# Altium project PCB_Project.PrjPcb
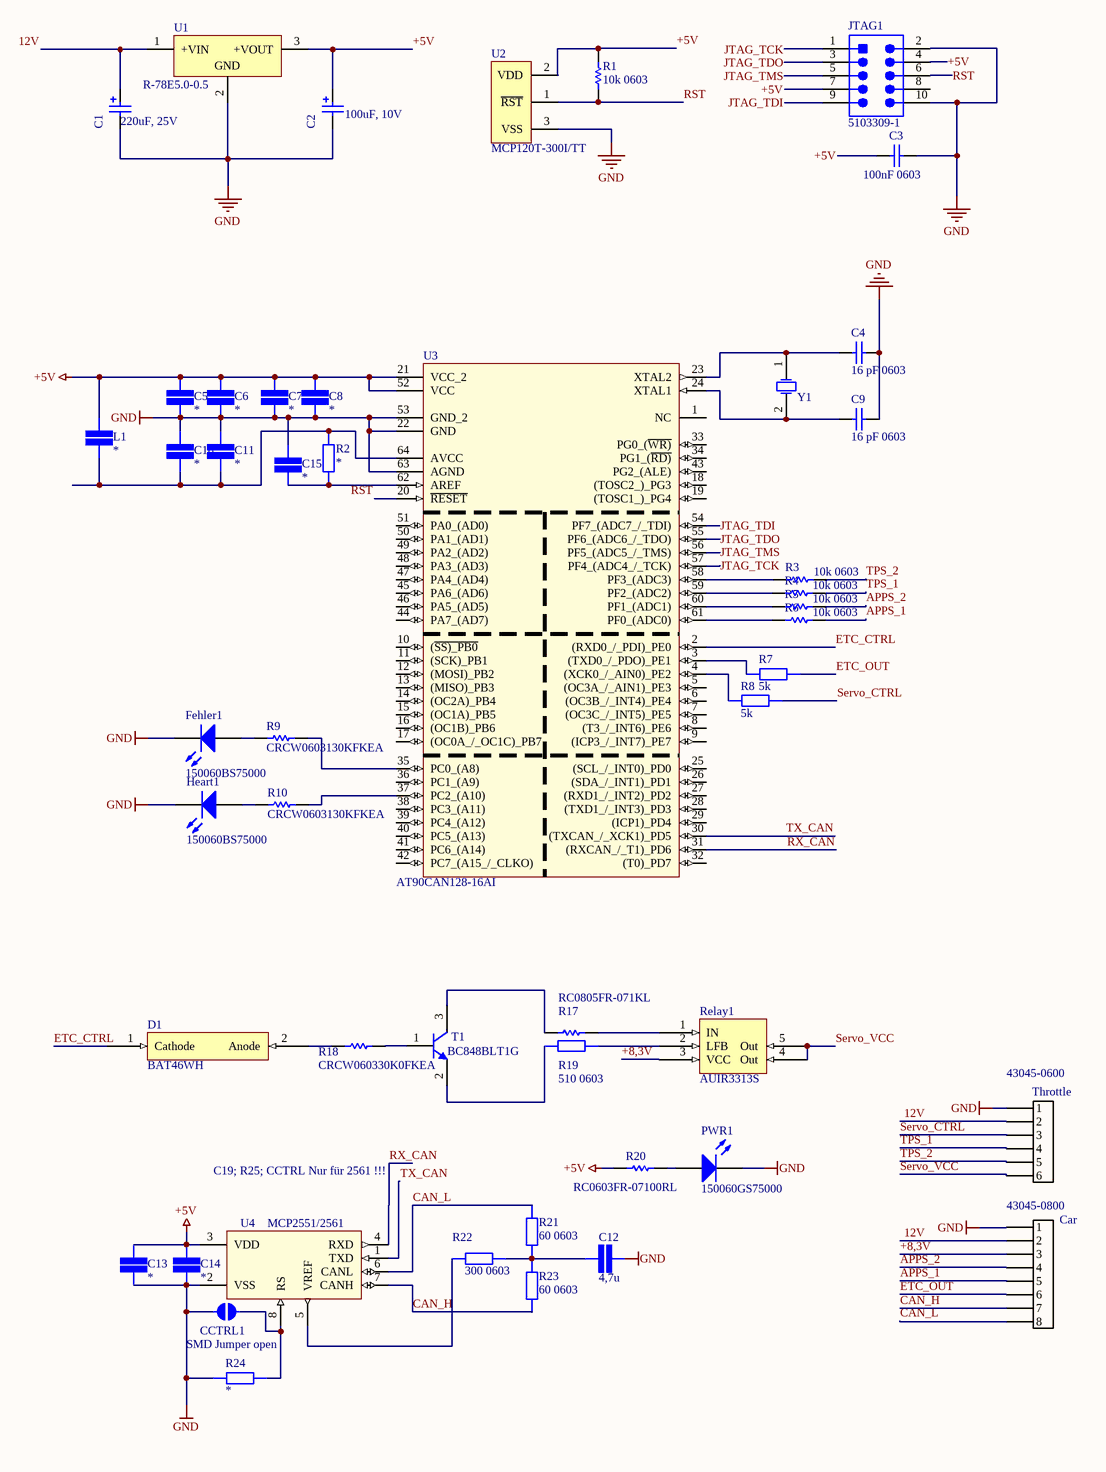
[diagram p0: Main_ETC.SchDoc]
1 sheet, 49 parts. Net scope: global (net labels, ports and power ports of the same name join across sheets).
Board file: PCB_ETCV1_1.PcbDoc

## Sheet Main_ETC.SchDoc
size A3

### Parts
C1  220uF, 25V  [WCAP-ATET_10x12.5]
C2  100uF, 10V  [WCAP-ASLU_6.3x7.7]
C3  100nF 0603  [CAPC0603(1608)100_L]
C4  16 pF 0603  [CAPC0603(1608)100_L]
C5  SMD Capacitor  [CAP 0603/1608]  (value not drawn)
C6  SMD Capacitor  [CAP 0603/1608]  (value not drawn)
C7  SMD Capacitor  [CAP 0603/1608]  (value not drawn)
C8  SMD Capacitor  [CAP 0603/1608]  (value not drawn)
C9  16 pF 0603  [CAPC0603(1608)100_L]
C10  SMD Capacitor  [CAP 0603/1608]  (value not drawn)
C11  SMD Capacitor  [CAP 0603/1608]  (value not drawn)
C12  value 4,7u  [CAP 0603/1608]  (hidden comment: SMD Capacitor)
C13  SMD Capacitor  [CAP 0603/1608]  (value not drawn)
C14  SMD Capacitor  [CAP 0603/1608]  (value not drawn)
C15  SMD Capacitor  [CAP 0603/1608]  (value not drawn)
Car  43045-0800  [43045-0800]
CCTRL1  SMD Jumper open  [SMD-JUMPER-OPEN]  (no BOM)
D1  BAT46WH  [DIOM2715X18N]
Fehler1  150060BS75000  [0603_A]
Heart1  150060BS75000  [0603_A]
JTAG1  5103309-1  [TECO-5103309-1_V]
L1  SMD Capacitor  [CAP 0603/1608]  (value not drawn)
PWR1  150060GS75000  [0603_A]
R1  10k 0603  [RESC0603(1608)_N]
R2  SMD Resistor  [STACKPOLE CSR0603]  (value not drawn)
R3  10k 0603  [RESC0603(1608)_N]
R4  10k 0603  [RESC0603(1608)_N]
R5  10k 0603  [RESC0603(1608)_N]
R6  10k 0603  [RESC0603(1608)_N]
R7  value 5k  [STACKPOLE CSR0603]  (hidden comment: SMD Resistor)
R8  value 5k  [STACKPOLE CSR0603]  (hidden comment: SMD Resistor)
R9  CRCW0603130KFKEA  [RESC1609X50X30NL10T20]
R10  CRCW0603130KFKEA  [RESC1609X50X30NL10T20]
R17  RC0805FR-071KL  [RESC2013X60X35ML10T20]
R18  CRCW060330K0FKEA  [RESC1609X50X30LL10T20]
R19  value 510 0603  [STACKPOLE CSR0603]  (hidden comment: SMD Resistor)
R20  RC0603FR-07100RL  [RESC1608X55X25ML10T15]
R21  value 60 0603  [STACKPOLE CSR0603]  (hidden comment: SMD Resistor)
R22  value 300 0603  [STACKPOLE CSR0603]  (hidden comment: SMD Resistor)
R23  value 60 0603  [STACKPOLE CSR0603]  (hidden comment: SMD Resistor)
R24  SMD Resistor  [STACKPOLE CSR0603]  (value not drawn)
Relay1  AUIR3313S  [D2PAK5 ;DPAK228P1524X483-5N]
T1  BC848BLT1G  [ONSC-SOT-23-3-318-08_V]
Throttle  43045-0600  [43045-0600]
U1  R-78E5.0-0.5  [REPO-R-78E-0.5-3_V]
U2  MCP120T-300I/TT  [SOT-23-TT3_N]
U3  AT90CAN128-16AI  [*QFP80P1600X1600X120-64N]
U4  MCP2551/2561  [*SOIC127P600X175-8N]
Y1  16MHz, +/-30ppm, 16pF  [WE-XTAL_HC49/4HSMX]  (value not drawn)

### Nets
+5V: C2.2(P) C3.1 C5.2 C6.2 C7.2 C8.2 C13.2 C14.2 JTAG1.4 JTAG1.7 L1.2 R1.1 R20.1 U1.3(+VOUT) U2.2(VDD) U3.21(VCC_2) U3.52(VCC) U4.3(VDD)
GND: C1.1(N) C2.1(N) C3.2 C4.2 C5.1 C6.1 C7.1 C8.1 C9.2 C10.2 C11.2 C13.1 C14.1 C15.2 Car.1 CCTRL1.1 Fehler1.1(K) Heart1.1(K) JTAG1.2 JTAG1.10 PWR1.1(K) R24.1 Throttle.1 U1.2(GND) U2.3(VSS) U3.22(GND) U3.53(GND_2) U3.63(AGND) U4.2(VSS)
12V: C1.2(P) Car.2 Throttle.2 U1.1(+VIN)
+8,3V: Car.3 Relay1.3(VCC)
APPS_1: Car.5 R6.1
APPS_2: Car.4 R5.1
CAN_H: Car.7 R23.2 U4.7(CANH)
CAN_L: Car.8 R21.1 U4.6(CANL)
ETC_CTRL: D1.1(Cathode) U3.2((RXD0_/_PDI)_PE0)
ETC_OUT: Car.6 R7.1
JTAG_TCK: JTAG1.1 U3.57(PF4_(ADC4_/_TCK))
JTAG_TDI: JTAG1.9 U3.54(PF7_(ADC7_/_TDI))
JTAG_TDO: JTAG1.3 U3.55(PF6_(ADC6_/_TDO))
JTAG_TMS: JTAG1.5 U3.56(PF5_(ADC5_/_TMS))
RST: JTAG1.6 R1.2 U2.1(~{RST}) U3.20(~{RESET})
RX_CAN: U3.31((RXCAN_/_T1)_PD6) U4.4(RXD)
Servo_CTRL: R8.1 Throttle.3
Servo_VCC: Relay1.4(Out) Relay1.5(Out) Throttle.6
TPS_1: R4.1 Throttle.4
TPS_2: R3.1 Throttle.5
TX_CAN: U3.30((TXCAN_/_XCK1)_PD5) U4.1(TXD)
NetC4_1: C4.1 U3.23(XTAL2) Y1.1(OSC1)
NetC9_1: C9.1 U3.24(XTAL1) Y1.2(OSC2)
NetC10_1: C10.1 C11.1 L1.1 R2.2 U3.64(AVCC)
NetC12_1: C12.1 R21.2 R22.2 R23.1
NetC15_1: C15.1 R2.1 U3.62(AREF)
NetCCTRL1_2: CCTRL1.2 R24.2 U4.8(RS)
NetD1_2: D1.2(Anode) R18.1
NetFehler1_2: Fehler1.2(A) R9.2
NetHeart1_2: Heart1.2(A) R10.2
NetPWR1_2: PWR1.2(A) R20.2
NetR3_2: R3.2 U3.58(PF3_(ADC3))
NetR4_2: R4.2 U3.59(PF2_(ADC2))
NetR5_2: R5.2 U3.60(PF1_(ADC1))
NetR6_2: R6.2 U3.61(PF0_(ADC0))
NetR7_2: R7.2 U3.3((TXD0_/_PDO)_PE1)
NetR8_2: R8.2 U3.4((XCK0_/_AIN0)_PE2)
NetR9_1: R9.1 U3.35(PC0_(A8))
NetR10_1: R10.1 U3.37(PC2_(A10))
NetR17_1: R17.1 T1.3(C)
NetR17_2: R17.2 Relay1.1(IN)
NetR18_2: R18.2 T1.1(B)
NetR19_1: R19.1 T1.2(E)
NetR19_2: R19.2 Relay1.2(LFB)
NetR22_1: R22.1 U4.5(VREF)

Not connected (* = marked no-connect by the designer): C12 2; JTAG1 8; U3 1(NC) 5((OC3A_/_AIN1)_PE3) 6((OC3B_/_INT4)_PE4) 7((OC3C_/_INT5)_PE5) 8((T3_/_INT6)_PE6) 9((ICP3_/_INT7)_PE7) 10((~{SS)_PB0}) 11((SCK)_PB1) 12((MOSI)_PB2) 13((MISO)_PB3) 14((OC2A)_PB4) 15((OC1A)_PB5) 16((OC1B)_PB6) 17((OC0A_/_OC1C)_PB7) 18((TOSC2_)_PG3) 19((TOSC1_)_PG4) 25((SCL_/_INT0)_PD0) 26((SDA_/_INT1)_PD1) 27((RXD1_/_INT2)_PD2) 28((TXD1_/_INT3)_PD3) 29((ICP1)_PD4) 32((T0)_PD7) 33(PG0_(~{WR)}) 34(PG1_(~{RD)}) 36(PC1_(A9)) 38(PC3_(A11)) 39(PC4_(A12)) 40(PC5_(A13)) 41(PC6_(A14)) 42(PC7_(A15_/_CLKO)) 43(PG2_(ALE)) 44(PA7_(AD7)) 45(PA6_(AD6)) 46(PA5_(AD5)) 47(PA4_(AD4)) 48(PA3_(AD3)) 49(PA2_(AD2)) 50(PA1_(AD1)) 51(PA0_(AD0))

### Notes on the sheet
- C19; R25; CCTRL Nur für 2561 !!!
- Labels drawn without touching a wire or pin: GND

### Library data of the parts
C1 = 860130475006: WCAP-ATET THT Aluminum Electrolytic Capacitors, D10mm x L12.5mm, 220uF, +/-20%, 25VDC; Dissipation Factor: 13%; Endurance: 2000h; Leakage Current: 55uA; Ripple Current max.: 420mA; Technical Reference: ATGF125221M025DSPA9B000; ComponentLink1Description: Manufacturer; ComponentLink1URL: http://www.we-online.de; ComponentLink2Description: Datasheet; ComponentLink2URL: https://katalog.we-online.com/pbs/datasheet/860130475006.pdf; Length: 12.5mm; Mounting Technology: THT; Operating Temperature: -40 to +125degC; Packaging: Ammo Pack; Published Date: August 2019; Capacitance: 220uF; Diameter: 10mm; Part Number: 860130475006; Publisher: Wurth Elektronik; Capacitance Tolerance: +/-20%; Rated Voltage: 25VDC
C2 = 865090245005: WCAP-ASLU Aluminium Electrolytic Capacitors, D6.3mm x L7.7mm, 100uF, +/-20%, 10VDC; Dissipation Factor: 22%; Leakage Current: 2uA; Endurance: 1000h; Technical Reference: ASBD077101M010DVCTCA000; Ripple Current max.: 75mA; ComponentLink1Description: Manufacturer; ComponentLink1URL: http://www.we-online.de; ComponentLink2Description: Datasheet; ComponentLink2URL: https://katalog.we-online.com/pbs/datasheet/865090245005.pdf; Mounting Technology: SMD; Operating Temperature: -40 to +85degC; Packaging: Tape and Reel; Part Number: 865090245005; Publisher: Wurth Elektronik; Capacitance: 100uF; Diameter: 6.3mm; Length: 7.7mm; Published Date: August 2019; Rated Voltage: 10VDC; Capacitance Tolerance: +/-20%
C3 C4 C9 = CMP-1035-02579-1: CAP 100nF 10V ±5% 0603 (1608 Metric) Thickness 1mm SMD; Tolerance: Â±5%; Case-EIA: 0603; Case-Metric: 1608; Value: 100nF; Max Thickness: 1 mm; Rated Voltage: 10 V; Technology: SMT
C5-C8 C10-C15 L1 = SMD Capacitor: Capacitor with multiple Footprints
  C5-C8 C10 C11 C13-C15 L1: Value: *
Car = MicroFit3.0 8-Pin: Molex Micro-Fit 3.0 8-Pin / 600V / 8.5A
Fehler1 Heart1 = CMP-1426-00003-1: SMD mono-color Chip LED, WL-SMCW, Blue; Manufacturer: Wuerth Elektronik; Color: Blue; ComponentLink2Description: Datasheet; ComponentLink2URL: http://katalog.we-online.com/led/datasheet/150060BS75000.pdf; ComponentLink1URL: http://www.we-online.com; PackageReference: 0603_A; PartNumber: 150060BS75000; ComponentLink1Description: Manufacturer URL
JTAG1 = CMP-2000-07502-1: Male Header, Pitch 2.54 mm, 2 x 5 Position, Height 9.855 mm, Tail Length 3.048 mm, -65 to 105 degC, RoHS, Tube; Manufacturer: TE Connectivity; PCB Mounting Orientation: Vertical; Pitch: 2.54mm; Mating Connector Lock: No(Without); Body Material: Thermoplastic; Shrouded: Yes(With); Connector System: Wire-to-Board; Insulation Resistance: 5GR; Number of Positions: 10; Max Current Rating: 1A; PCB Mount Retention: Without; Manufacturer URL: http://www.te.com/; Contact Plating: Gold; Datasheet URL: http://www.te.com/commerce/DocumentDelivery/DDEController?Action=showdoc&DocId=Customer+Drawing%7F5103309%7FE1%7Fpdf%7FEnglish%7FENG_CD_5103309_E1.pdf%7F5103309-1; Colour: Black; Termination: ThroughHole; Housing Colour: Black; Flammability Rating: UL94V-0; Package Description: Male Header, Pitch 2.54 mm, 2 x 5 Position, Height 9.855 mm, Tail Length 3.048 mm; Mating Retention: No(Without); Orientation: Straight; Row Spacing: 2.54mm; Termination Post Length: 0.12inch; Min Operating Temperature: -65degC; Board Standoff: Yes(With); REACH SVHC: NoSVHC; Depth: 9.14mm; Lead Free: LeadFree; Gender: Male; Connector Type: Header; Shrouded End Dimension: 3.81mm; ELV: Compliant; Mating Alignment: Yes(With); Panel Mount Retention: No(Without); Package Quantity: 35; PCB Mount Alignment: No(Without); Number of Rows: 2; Package Reference: 5103309-1; Mounting Technology: ThroughHole; Mount: ThroughHole; Contact Gender: Male; Number of Contacts: 10; Length: 0.8inch; Current Rating: 1A; Contact Mating Length: 0.24inch; Max Operating Temperature: 105degC; RoHSCompliant: True; Datasheet Version: Rev. E1, 03/2011; Contact Shape: Square; Height: 8.813mm; Housing Material: PBT; Contact Material: CopperAlloy; Packaging: Rail/Tube
PWR1 = CMP-1426-00002-1: SMD mono-color Chip LED, WL-SMCW, Green; Manufacturer: Wuerth Elektronik; ComponentLink1URL: http://www.we-online.com; ComponentLink2Description: Datasheet; Color: Green; ComponentLink2URL: http://katalog.we-online.com/led/datasheet/150060GS75000.pdf; PartNumber: 150060GS75000; PackageReference: 0603_A; ComponentLink1Description: Manufacturer URL
R1 R3-R6 = CMP-1012-00408-1: 127R 0.1W 1% 0603 (1608 Metric)  SMD; Case-Metric: 1608; Value: 127.00 Ohm; Case-EIA: 0603; Power: 0.1 W; Tolerance: 1 %; Technology: SMT
R2 R7 R8 R19 R21-R24 = SMD Resistor: Resistor with multiple footprints
  R2 R24: Value: *
R9 R10 = CMP-2000-03887-1: Manufacturer: Vishay Dale; Part Number: CRCW0603130KFKEA
R17 = CMP-2100-03671-1: Chip Resistor, 1 KOhm, +/- 1%, 125 mW, -55 to 155 degC, 0805 (2012 Metric), RoHS, Tape and Reel; Manufacturer: Yageo; Temperature Coefficient: 100ppm/degreesC; Voltage Rating (DC): 150V; Max Power Dissipation: 125mW; Resistance: 1KOhm; Number of Pins: 2; Number of Terminations: 2; Datasheet URL: http://www.yageo.com/NewPortal/yageodocoutput?fileName=/pdf/R-Chip/PYu-RC_Group_51_RoHS_L_5.pdf; Length: 0.079inch; Package Description: 2-Pin Surface Mounted Device, Body 2 x 1.25 mm; Depth: 1.25mm; Height: 0.024inch; Military Standard: Not; Case/Package: 0805; Package Reference: 0805; RoHSCompliant: true; Lead Free: LeadFree; Packaging: TapeandReel; Package Quantity: 1; Datasheet Version: Rev. 5, 10/2016; Tolerance: 1%; Min Operating Temperature: -55degC; Voltage Rating: 150V; Composition: ThickFilm; Case Code (Imperial): 0805; Power Rating: 125mW; Width: 0.049inch; Case Code (Metric): 2012; Manufacturer URL: http://www.yageo.com/; Max Operating Temperature: 155degC; REACH SVHC: Unknown; Termination: SMD/SMT
R18 = CMP-2000-03223-1: Manufacturer: Vishay Dale; Part Number: CRCW060330K0FKEA
R20 = CMP-2100-03663-1: Chip Resistor, 100 Ohm, +/- 1%, 0.1 W, -55 to 155 degC, 0603 (1608 Metric), RoHS, Tape and Reel; Manufacturer: Yageo; Voltage Rating (DC): 50V; Power Rating: 100mW; Resistance: 100Ohm; Temperature Coefficient: 100ppm/degreesC; Number of Pins: 2; Tolerance: 1%; Height: 0.45mm; Manufacturer URL: http://www.yageo.com/; Military Standard: Not; Datasheet URL: http://www.yageo.com/NewPortal/yageodocoutput?fileName=/pdf/R-Chip/PYu-RC_Group_51_RoHS_L_5.pdf; Case Code (Imperial): 0603; Termination: SMD/SMT; Lead Free: LeadFree; Max Operating Temperature: 155degC; Case Code (Metric): 1608; RoHSCompliant: true; Voltage Rating: 50V; Width: 0.8mm; Composition: ThickFilm; Depth: 0.8mm; REACH SVHC: Unknown; Min Operating Temperature: -55degC; Packaging: TapeandReel; Package Description: 2-Pin Surface Mount Device, Body 1.6 x 0.8 mm; Length: 1.6mm; Package Reference: 0603; Datasheet Version: Rev. 5, 10/2016; Case/Package: 0603
T1 = CMP-1048-00679-1: General Purpose Transistor, NPN Silicon, 3-Pin SOT-23, Pb-Free, Tape and Reel; Manufacturer: On Semiconductor; fT Min (MHz): 100; IC Continuous (A): 0.1; DatasheetVersion: Rev. 11; PackageVersion: Rev. AP, 11/2009; RoHS: TRUE; PartNumber: BC848BLT1G; ComponentLink1Description: Manufacturer URL; PackageReference: SOT-23-3-318-08; ComponentLink3Description: Package Specification; ComponentLink1URL: http://www.onsemi.com/; Polarity: NPN; ComponentLink2Description: Datasheet; ComponentLink2URL: http://www.onsemi.cn/pub_link/Collateral/BC846ALT1-D.PDF; ComponentLink3URL: http://www.onsemi.cn/pub_link/Collateral/318-08.PDF; PackageDescription: 3-Pin Small Outline Transistor, Body 2.92 x 1.3 mm, Pitch 0.95 mm; Packing: Tape and Reel; Mounting Technology: Surface Mount
Throttle = MicroFit3.0 6-Pin: Molex Micro-Fit 3.0 6-Pin / 600V / 8.5A
U1 = CMP-2000-06922-2: DC/DC-Converter, 5 V Single Output, 500 mA, -40 to 85 degC, 3-Pin THD, RoHS, Tube; Manufacturer: Recom Power; Efficiency: 92%; Number of Outputs: 1; Current - Output (Max): 500mA; VIN Min: 7V; Package Version: Rev. 0; VIN Max: 28V; VOUT: 5V; Manufacturer URL: http://www.recom-power.com/us/americas/home.html; Operating Temperature: -40°C~85°C; Datasheet Version: 01/2017; Packaging: Tube; Package Reference: SIP Module; Datasheet URL: http://www.recom-power.com/pdf/Innoline/R-78Exx-0.5.pdf; Package Description: 3-Pin Through Hole Device, Body 11.6 x 8.5 mm, Pitch 2.54 mm; Mounting Technology: ThroughHole
U2 = CMP-0138-00362-1: Microcontroller Supervisory Circuit with Open Drain Output, 3-Pin SOT-23, Industrial Temperature, Tape and Reel; PackageDescription: 3-Lead Plastic Small Outline Transistor (TT) [SOT-23]; PackageVersion: revBB, Aug-2009; PackageReference: SOT-23-TT3; Code_IPC: SOT23-3; DatasheetVersion: revD, 2001
U3 = AT90CAN128-16AI: Ic Mcu 8bit 128kb Flash 64tqfp; MF: Microchip; MP: AT90CAN128-16AI; Package: TQFP-64 Microchip; SnapEDA_Link: https://www.snapeda.com/parts/AT90CAN128-16AI/Microchip/view-part/?ref=snap; Price: None; Availability: Unavailable; Value: *
U4 = MCP2551-I/SN: MCP2551 Series 5.5 V 1 Mb/s Surface Mount High-Speed CAN Transceiver - SOIC-8; MF: Microchip; MP: MCP2551-I/SN; SnapEDA_Link: https://www.snapeda.com/parts/MCP2551-I/SN/Microchip/view-part/?ref=snap; Price: None; Package: SOIC-8 Microchip; Availability: Unavailable; Value: *
Y1 = 830003237: WE-XTAL Quartz Crystal, size HC49-4HSMX, 16MHz, +/-30ppm, 16pF; Frequency Stability: 50ppm; ComponentLink1Description: Manufacturer; ComponentLink1URL: http://www.we-online.de; ComponentLink2Description: Datasheet; ComponentLink2URL: https://katalog.we-online.com/pbs/datasheet/830003237.pdf; Part Number: 830003237; Published Date: March 2019; Publisher: Wurth Elektronik; Size: HC49-4HSMX; Operating Temperature: -10 up to +60degC; Mounting Technology: SMT; Packaging: Tape and Reel; Load Capacitance: 16pF; Frequency Tolerance: +/-30ppm; Frequency: 16MHz